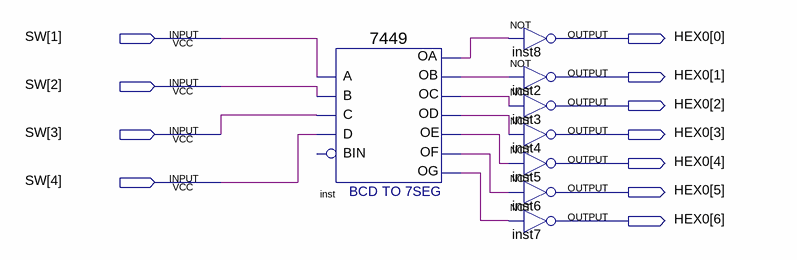
[diagram p0: schematic sheet]
// Quartus schematic MeioSomador.bdf as structural Verilog: 8 symbols, 11 pins
module MeioSomador (
  input  [4:1] SW,
  output [6:0] HEX0
);

  wire inst_oa, inst_ob, inst_oc, inst_od, inst_oe, inst_of, inst_og;

  \7449  inst (
    .A(SW[1]), .C(SW[3]), .B(SW[2]), .D(SW[4]), .OC(inst_oc), .OD(inst_od), .OF(inst_of), .OG(inst_og),
    .OB(inst_ob), .OA(inst_oa), .OE(inst_oe));  // open: BIN
  not inst8 (HEX0[0], inst_oa);
  not inst2 (HEX0[1], inst_ob);
  not inst3 (HEX0[2], inst_oc);
  not inst4 (HEX0[3], inst_od);
  not inst5 (HEX0[4], inst_oe);
  not inst6 (HEX0[5], inst_of);
  not inst7 (HEX0[6], inst_og);
endmodule
